# Altium project multimeter.prjpcb
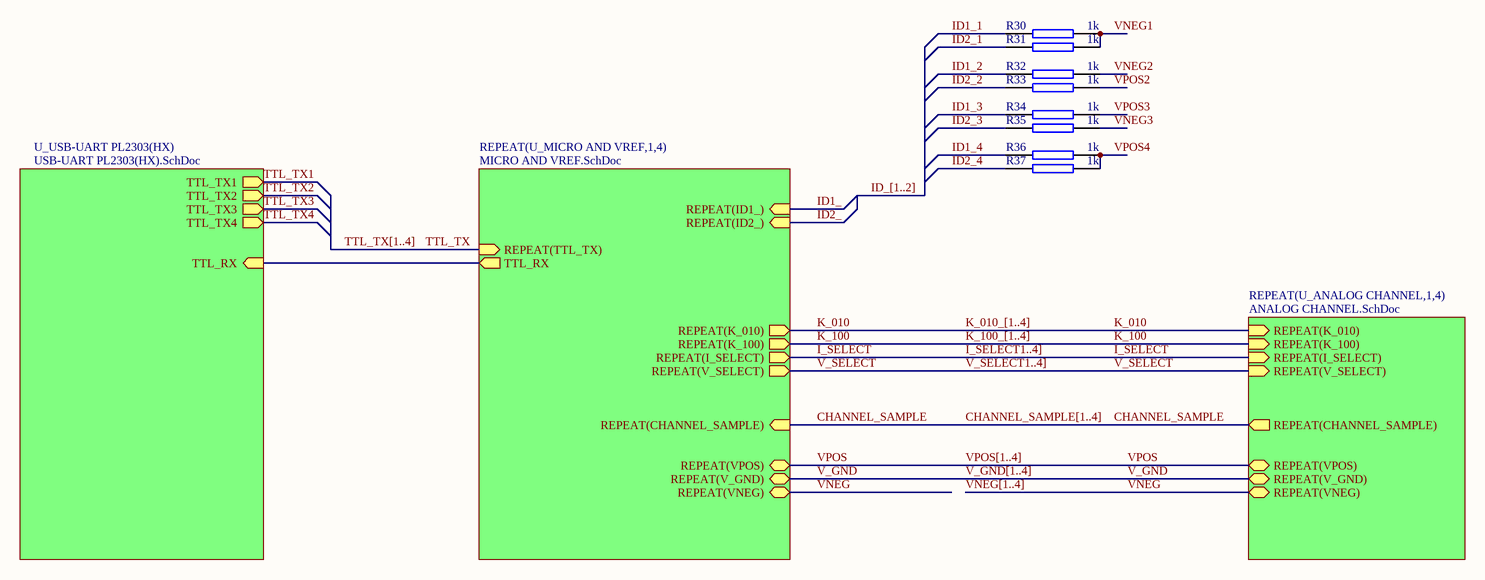
[diagram p0: Multi2Meter.SchDoc]
4 sheets, 194 parts. Net scope: hierarchical (ports join the sheet entries above them; power ports are global).
Board files: m2m V00 End Plate V100.PcbDoc, m2m V00 End Plate 01.PcbDoc, m2m V100.PcbDoc
Sheets:
  Multi2Meter.SchDoc
    U_ANALOG CHANNEL1 = ANALOG CHANNEL.SchDoc
    U_ANALOG CHANNEL2 = ANALOG CHANNEL.SchDoc
    U_ANALOG CHANNEL3 = ANALOG CHANNEL.SchDoc
    U_ANALOG CHANNEL4 = ANALOG CHANNEL.SchDoc
    U_MICRO AND VREF1 = MICRO AND VREF.SchDoc
    U_MICRO AND VREF2 = MICRO AND VREF.SchDoc
    U_MICRO AND VREF3 = MICRO AND VREF.SchDoc
    U_MICRO AND VREF4 = MICRO AND VREF.SchDoc
    U_USB-UART PL2303(HX) = USB-UART PL2303(HX).SchDoc

## Sheet Multi2Meter.SchDoc
size A3

### Parts
R30  1k  [RES (3D) - 0603]
R31  1k  [RES (3D) - 0603]
R32  1k  [RES (3D) - 0603]
R33  1k  [RES (3D) - 0603]
R34  1k  [RES (3D) - 0603]
R35  1k  [RES (3D) - 0603]
R36  1k  [RES (3D) - 0603]
R37  1k  [RES (3D) - 0603]

### Sub-sheets
REPEAT(U_ANALOG CHANNEL,1,4) = ANALOG CHANNEL.SchDoc: REPEAT(K_010) (in), REPEAT(K_100) (in), REPEAT(I_SELECT) (in), REPEAT(V_SELECT) (in), REPEAT(CHANNEL_SAMPLE) (out), REPEAT(V_GND) (bidir), REPEAT(VPOS) (bidir), REPEAT(VNEG) (bidir)
REPEAT(U_MICRO AND VREF,1,4) = MICRO AND VREF.SchDoc: REPEAT(TTL_TX) (in), TTL_RX, REPEAT(K_010) (out), REPEAT(K_100) (out), REPEAT(I_SELECT) (out), REPEAT(V_SELECT) (out), REPEAT(CHANNEL_SAMPLE) (in), REPEAT(V_GND) (bidir), REPEAT(VPOS) (bidir), REPEAT(VNEG) (bidir), REPEAT(ID1_) (in), REPEAT(ID2_) (in)
U_USB-UART PL2303(HX) = USB-UART PL2303(HX).SchDoc: TTL_TX1 (out), TTL_TX2 (out), TTL_TX3 (out), TTL_TX4 (out), TTL_RX (in)

### Nets
CHANNEL_SAMPLE: sheet REPEAT(U_ANALOG CHANNEL,1,4)/REPEAT(CHANNEL_SAMPLE), sheet REPEAT(U_MICRO AND VREF,1,4)/REPEAT(CHANNEL_SAMPLE)
I_SELECT: sheet REPEAT(U_ANALOG CHANNEL,1,4)/REPEAT(I_SELECT), sheet REPEAT(U_MICRO AND VREF,1,4)/REPEAT(I_SELECT)
ID1_: sheet REPEAT(U_MICRO AND VREF,1,4)/REPEAT(ID1_)
ID1_1: R30.1  [project net ID1_]
ID1_2: R32.1  [project net ID1_]
ID1_3: R34.1  [project net ID1_]
ID1_4: R36.1  [project net ID1_]
ID2_: sheet REPEAT(U_MICRO AND VREF,1,4)/REPEAT(ID2_)
ID2_1: R31.1  [project net ID2_]
ID2_2: R33.1  [project net ID2_]
ID2_3: R35.1  [project net ID2_]
ID2_4: R37.1  [project net ID2_]
K_010: sheet REPEAT(U_ANALOG CHANNEL,1,4)/REPEAT(K_010), sheet REPEAT(U_MICRO AND VREF,1,4)/REPEAT(K_010)
K_100: sheet REPEAT(U_ANALOG CHANNEL,1,4)/REPEAT(K_100), sheet REPEAT(U_MICRO AND VREF,1,4)/REPEAT(K_100)
TTL_RX: sheet REPEAT(U_MICRO AND VREF,1,4)/TTL_RX, sheet U_USB-UART PL2303(HX)/TTL_RX
TTL_TX: sheet REPEAT(U_MICRO AND VREF,1,4)/REPEAT(TTL_TX)
V_GND: sheet REPEAT(U_ANALOG CHANNEL,1,4)/REPEAT(V_GND), sheet REPEAT(U_MICRO AND VREF,1,4)/REPEAT(V_GND)
V_SELECT: sheet REPEAT(U_ANALOG CHANNEL,1,4)/REPEAT(V_SELECT), sheet REPEAT(U_MICRO AND VREF,1,4)/REPEAT(V_SELECT)
VNEG: sheet REPEAT(U_ANALOG CHANNEL,1,4)/REPEAT(VNEG), sheet REPEAT(U_MICRO AND VREF,1,4)/REPEAT(VNEG)
VNEG1: R30.2 R31.2  [project net VNEG]
VNEG2: R32.2  [project net VNEG]
VNEG3: R35.2  [project net VNEG]
VPOS: sheet REPEAT(U_ANALOG CHANNEL,1,4)/REPEAT(VPOS), sheet REPEAT(U_MICRO AND VREF,1,4)/REPEAT(VPOS)
VPOS2: R33.2  [project net VPOS]
VPOS3: R34.2  [project net VPOS]
VPOS4: R36.2 R37.2  [project net VPOS]

### Buses and harness runs
bus CHANNEL_SAMPLE[1..4]
bus I_SELECT1..4]
bus ID_[1..2]
bus K_010_[1..4]
bus K_100_[1..4]
bus TTL_TX[1..4]
bus V_GND[1..4]
bus V_SELECT1..4]
bus VNEG[1..4]
bus VPOS[1..4]

### Library data of the parts
R30-R37 = RES SMD 0603: RESISTOR SMD 0603; value: 1k

## Sheet ANALOG CHANNEL.SchDoc
size A4; DrawnBy: SML; Revision: 0; SheetNumber: 2; Title2: Title2
Used 4 times, as channels U_ANALOG CHANNEL1, U_ANALOG CHANNEL2, U_ANALOG CHANNEL3, U_ANALOG CHANNEL4. Parts and nets are listed once, with the designators drawn on the sheet.
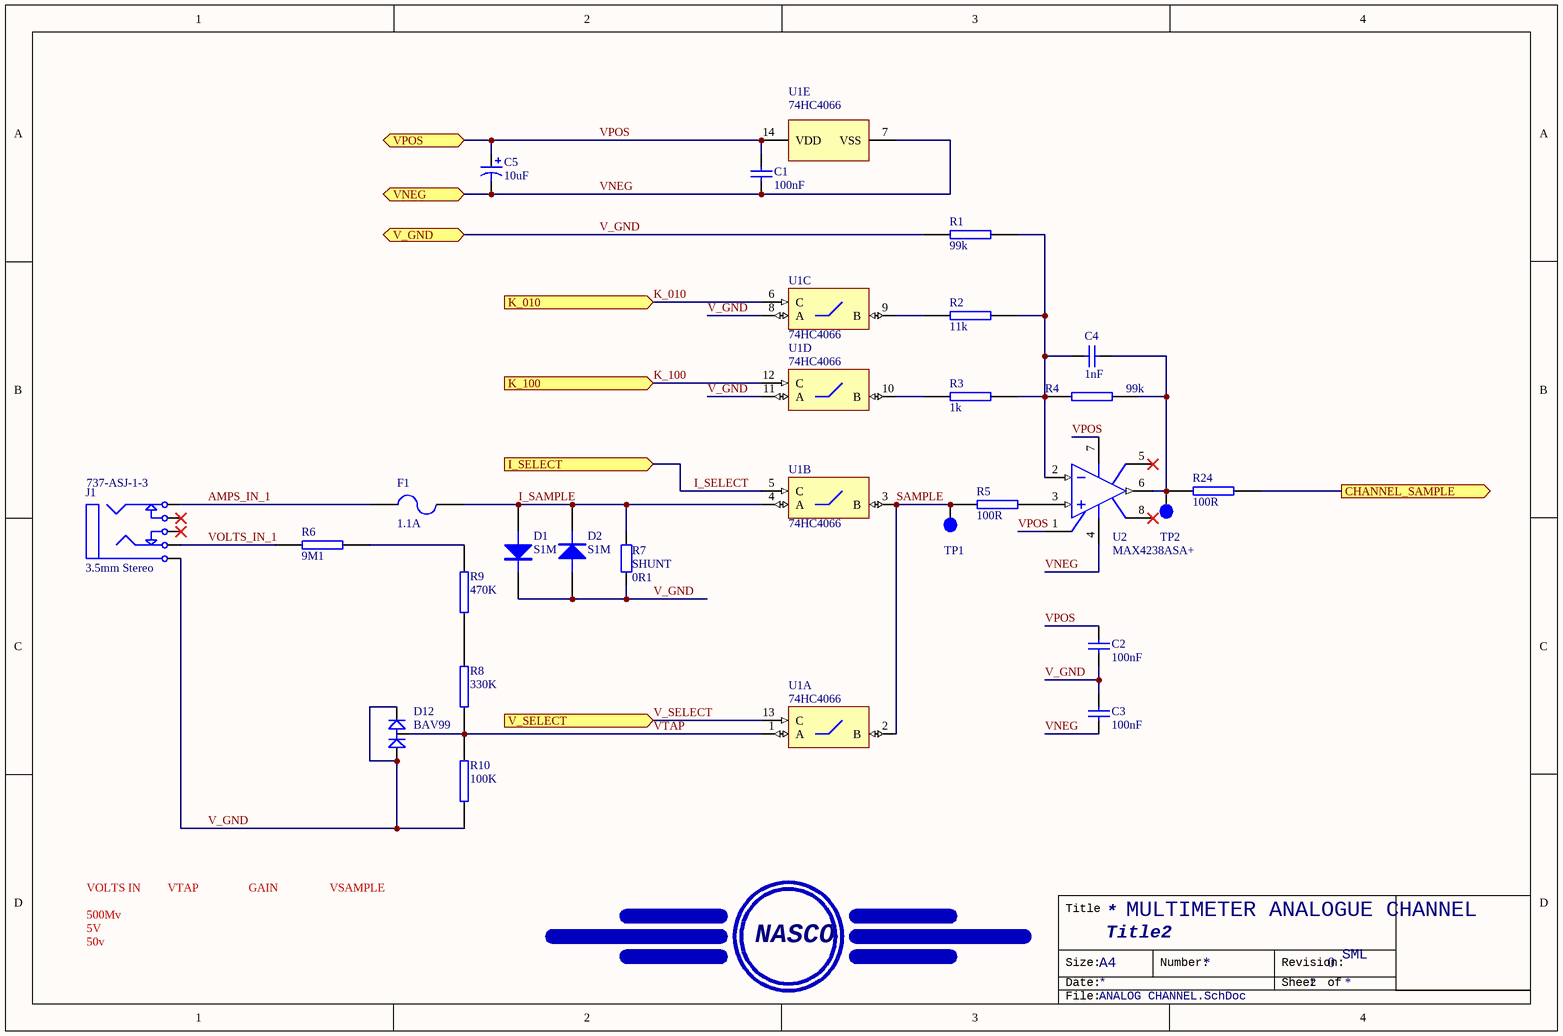
[diagram p1: ANALOG CHANNEL.SchDoc]

### Parts
?  (no value)  (no BOM)
C1  100nF  [CAP (3D) - 0603]
C2  100nF  [CAP (3D) - 0603]
C3  100nF  [CAP (3D) - 0603]
C4  1nF  [CAP (3D) - 0603]
C5  10uF  [CAP ELECTRO SIZE-B]
D1  S1M  [DO-214AC]
D2  S1M  [DO-214AC]
D12  BAV99  [SOT23-3L]
F1  1.1A  [LITTELFUSE 1210]
J1  3.5mm Stereo  Supplier Part Number 1: 737-ASJ-1-3  [3.5MM pcb mouNt]
R1  99k  [RES (3D) - 0603]
R2  11k  [RES (3D) - 0603]
R3  1k  [RES (3D) - 0603]
R4  99k  [RES (3D) - 0603]
R5  100R  [RES (3D) - 0603]
R6  9M1  [RES (3D) - 0603]
R7  SHUNT  value 0R1  [RES (3D) - 1210]
R8  330K  [RES (3D) - 0603]
R9  470K  [RES (3D) - 0603]
R10  100K  [RES (3D) - 0603]
R24  100R  [RES (3D) - 0603]
TP1  TestPoint  [TP]  (value not drawn)
TP2  TestPoint  [TP]  (value not drawn)
U1  74HC4066  [DIP-16]  (parts A,B,C,D,E of 5)
U2  MAX4238ASA+  [SO-8]

### Ports
CHANNEL_SAMPLE (out), I_SELECT (in), K_010 (in), K_100 (in), V_GND (bidir), V_SELECT (in), VNEG (bidir), VPOS (bidir)

### Nets
AMPS_IN_1: F1.1 J1.5
CHANNEL_SAMPLE: R24.2 ; port CHANNEL_SAMPLE
I_SAMPLE: D1.1(A) D2.2(K) F1.2 R7.2 U1.4(A)
I_SELECT: U1.5(C) ; port I_SELECT
K_010: U1.6(C) ; port K_010
K_100: U1.12(C) ; port K_100
SAMPLE: R5.1 TP1.1 U1.2(B) U1.3(B)
V_GND: C2.1 C3.2 D1.2(K) D2.1(A) D12.1(A1) D12.2(C2) J1.1 R1.1 R7.1 R10.2 U1.8(A) U1.11(A) ; port V_GND
V_SELECT: U1.13(C) ; port V_SELECT
VNEG: C1.1 C3.1 C5.2 U1.7(VSS) U2.4(VEE) ; port VNEG
VOLTS_IN_1: J1.2 R6.1
VPOS: C1.2 C2.2 C5.1 U1.14(VDD) U2.1(NULL) U2.7(VCC) ; port VPOS
VTAP: D12.3(C1/A2) R8.2 R10.1 U1.1(A)
NetC4_1: C4.1 R1.2 R2.2 R3.2 R4.1 U2.2(IN-)
NetC4_2: C4.2 R4.2 R24.1 TP2.1 U2.6(OUT)
NetR2_1: R2.1 U1.9(B)
NetR3_1: R3.1 U1.10(B)
NetR5_2: R5.2 U2.3(IN+)
NetR6_2: R6.2 R9.1
NetR8_1: R8.1 R9.2

Not connected (* = marked no-connect by the designer): J1 3* 4*; U2 5(NULL)* 8(NC)*

### Channels
U_ANALOG CHANNEL1: designators end in A; ports CHANNEL_SAMPLE=CHANNEL_SAMPLE I_SELECT=I_SELECT K_010=K_010 K_100=K_100 V_GND=V_GND V_SELECT=V_SELECT VNEG=VNEG VPOS=VPOS
U_ANALOG CHANNEL2: designators end in B; ports CHANNEL_SAMPLE=CHANNEL_SAMPLE I_SELECT=I_SELECT K_010=K_010 K_100=K_100 V_GND=V_GND V_SELECT=V_SELECT VNEG=VNEG VPOS=VPOS
U_ANALOG CHANNEL3: designators end in C; ports CHANNEL_SAMPLE=CHANNEL_SAMPLE I_SELECT=I_SELECT K_010=K_010 K_100=K_100 V_GND=V_GND V_SELECT=V_SELECT VNEG=VNEG VPOS=VPOS
U_ANALOG CHANNEL4: designators end in D; ports CHANNEL_SAMPLE=CHANNEL_SAMPLE I_SELECT=I_SELECT K_010=K_010 K_100=K_100 V_GND=V_GND V_SELECT=V_SELECT VNEG=VNEG VPOS=VPOS

### Notes on the sheet
- VOLTS IN
- 500Mv
- VTAP
- GAIN
- VSAMPLE
- MULTIMETER ANALOGUE CHANNEL
- 5V
- 50v
- Title
- NASCO
- Size:
- Date:
- A4
- Number:
- Revision:
- Sheet
- of
- File:

### Library data of the parts
? = NASCO_LOGO: LOGO
C1-C4 = Cap: Capacitor; Supplier 1: Mouser; Supplier 2: Digi-Key; Supplier Part Number 1: 603-C0603ZRY5V9BB104; Supplier Part Number 2: 311-1343-2-ND
  C1-C3: Value: 100nF
  C4: Value: 1nF
C5 = Cap Pol1: Polarized Capacitor (Radial); Value: 10uF
D1 D2 = DIODE: DIODE, POWER; Manufacturer: TAIWAN SEMI; Mouser Part no.: 821-S1M; Manufacturer Part No.: S1M; value: S1M; Web link: http://au.mouser.com/ProductDetail/Taiwan-Semiconductor/S1M/?qs=sGAEpiMZZMtEwUVCuofpuOlSmRjzJonf%252bmrIm0%252bGbjE%3d
D12 = BAV99: DUAL DIODE, BAV99; Manufacturer: FAIRCHILD SEMICONDUCTOR; Mouser Part no.: 771-BAV99/T3; Manufacturer Part No.: BAV99; value: BAV99; Web link: http://au.mouser.com/ProductDetail/NXP/BAV99-T3/?qs=84A%2fDAdkstK527JD1pwcnQ%3d%3d
F1 = Fuse 2: Fuse; Manufacturer: Littlefuse; Manufacturer Part No.: 1206L110THYR; Revision: July-2002: Re-released for DXP Platform.; Mouser Part No.: 576-1206L110THYR; Value: 1.1A; Web link: http://au.mouser.com/ProductDetail/Littelfuse/1206L110THYR/?qs=sGAEpiMZZMu7EFbsM1w0ne5Dyqsx7igC3NaPmo8Qtk8%3d
J1 = Phonejack Stereo SW: 3-Conductor Jack with 2 break contacts (normals) and 2 auxiliary make contacts; Altronics Part no.: P0073; Manufacturer: Neutrik; Manufacturer Part No.: NMJ6HFD2; Mouser Part no.: 550-20301; Web link: http://au.mouser.com/ProductDetail/Neutrik/NMJ6HFD2/?qs=y5MlCMoPWsng3r9W7xlRqw%3d%3d; Supplier 1: Mouser
R1-R5 R24 = RES SMD 0603: RESISTOR SMD 0603
  R1 R4: value: 99k
  R2: value: 11k
  R3: value: 1k
  R5 R24: value: 100R
R6 = RES SMD 0603 10k: RESISTOR SMD 0603 10k; Manufacturer: Vishay/Dale; Manufacturer Part No.: CRCW06038M06FKEA; Mouser Part no.: 71-CRCW0603-8.06M-E3; Web link: http://au.mouser.com/ProductDetail/Vishay/CRCW06038M06FKEA/?qs=y%252bMD5VLd6nuCUjzPeM%2fNuA%3d%3d; value: 9M1
R7 = Res2: Resistor; Published: 8-Jun-2000; LatestRevisionDate: 17-Jul-2002; LatestRevisionNote: Re-released for DXP Platform.; PackageReference: AXIAL-0.4; Publisher: Altium Limited; PackageDescription: Axial Device, Thru-Hole; 2 Leads; 0.4 in Pin Spacing
R8-R10 = RES SMD 0603 10k: RESISTOR SMD 0603 10k
  R8: value: 330K
  R9: value: 470K
  R10: value: 100K
U1 = 74HC4066: Quadruple Bilateral Analog Switch
U2 = MAX495CSA: Single Voltage-Feedback Operational Amplifier; Published: 23-Sep-2002; LatestRevisionDate: 13-Apr-2006; LatestRevisionNote: IPC-7351 Footprint Added.; DatasheetVersion: Rev 2; 9/96; PackageReference: NSO8; Publisher: Altium Limited; PackageDescription: 8-Pin Small Outline Integrated Circuit 1.27 mm Pitch; Code_JEDEC: MS-012-AA; Code_IPC: SOIC127P600-8; ComponentLink1Description: Manufacturer Link; ComponentLink1URL: http://www.maxim-ic.com/; ComponentLink2Description: Datasheet; ComponentLink2URL: http://pdfserv.maxim-ic.com/en/ds/MAX492-MAX495.pdf

## Sheet MICRO AND VREF.SchDoc
size A4
Used 4 times, as channels U_MICRO AND VREF1, U_MICRO AND VREF2, U_MICRO AND VREF3, U_MICRO AND VREF4. Parts and nets are listed once, with the designators drawn on the sheet.
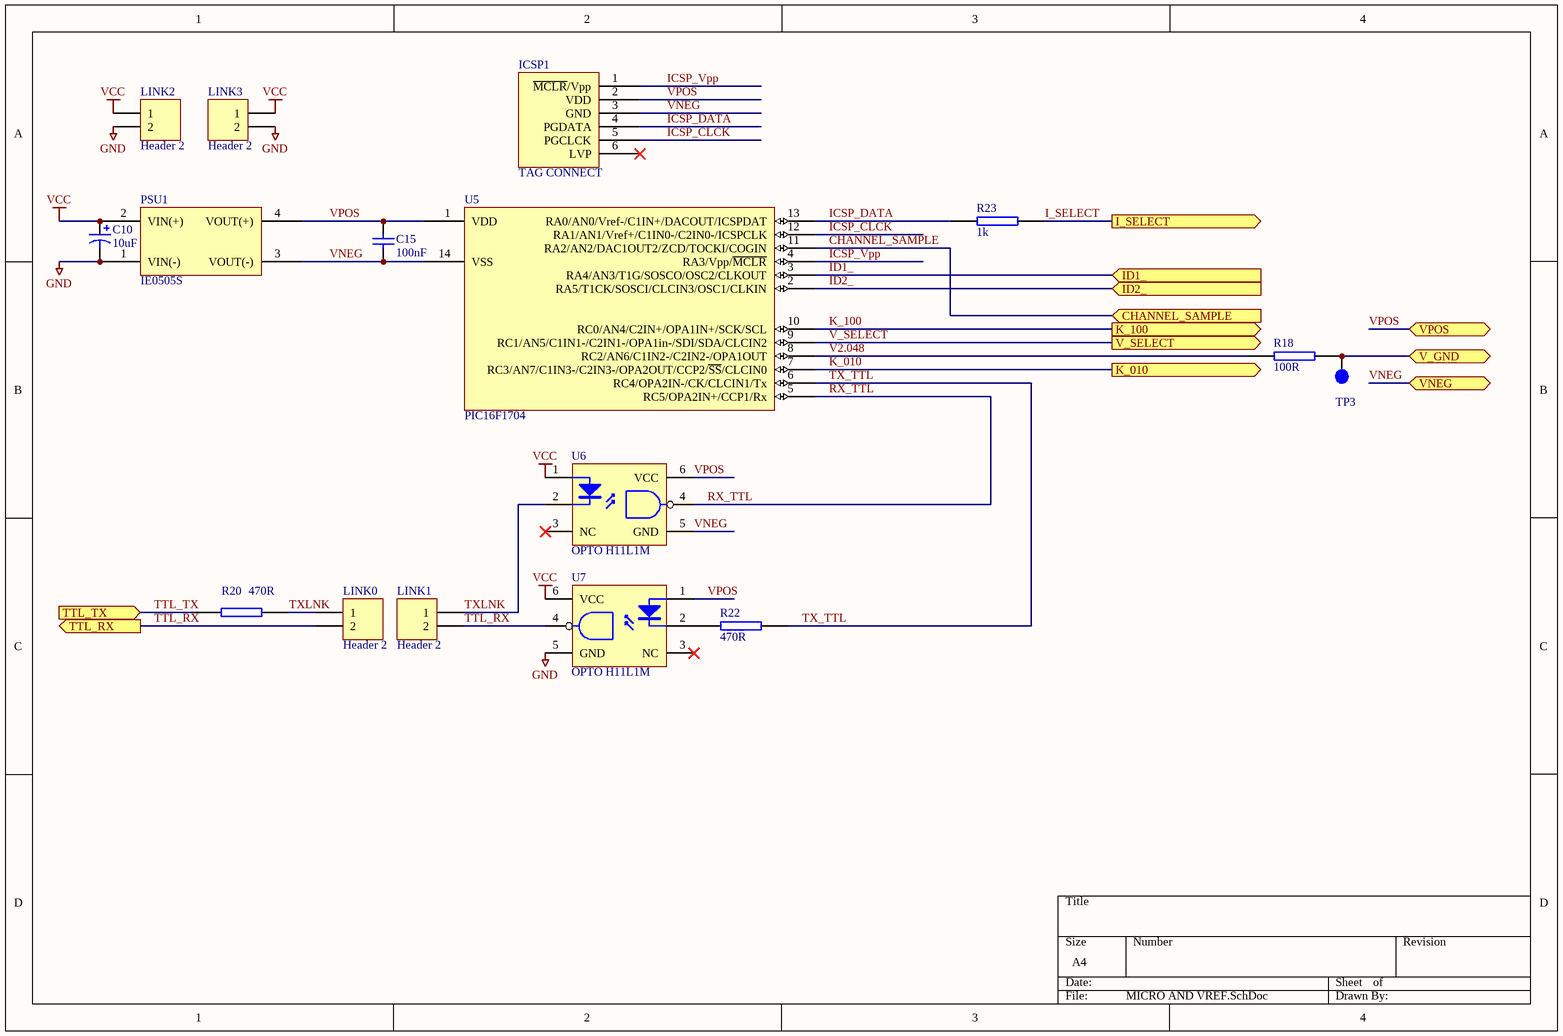
[diagram p2: MICRO AND VREF.SchDoc]

### Parts
C10  10uF  [CAP ELECTRO SIZE-B]
C15  100nF  [CAP (3D) - 0603]
ICSP1  TAG CONNECT  [ICSP - TAG CONNECT TYPE2]
LINK0  Header 2  [HDR1X2]
LINK1  Header 2  [HDR1X2]
LINK2  Header 2  [HDR1X2]
LINK3  Header 2  [HDR1X2]
PSU1  IE0505S  [IE0505S]
R18  100R  [RES (3D) - 0603]
R20  470R  [RES (3D) - 0603]
R22  470R  [RES (3D) - 0603]
R23  1k  [RES (3D) - 0603]
TP3  TestPoint  [TP]  (value not drawn)
U5  PIC16F1704  [SOIC-14]
U6  OPTO H11L1M  [DIP_6]
U7  OPTO H11L1M  [DIP_6]

### Ports
CHANNEL_SAMPLE (in), I_SELECT (out), ID1_ (in), ID2_ (in), K_010 (out), K_100 (out), TTL_RX, TTL_TX (in), V_GND (bidir), V_SELECT (out), VNEG, VPOS

### Nets
GND: C10.2 LINK2.2 LINK3.2 PSU1.1(VIN(-)) U7.5(GND)
VCC: C10.1 LINK2.1 LINK3.1 PSU1.2(VIN(+)) U6.1(A) U7.6(VCC)
CHANNEL_SAMPLE: U5.11(RA2/AN2/DAC1OUT2/ZCD/TOCKI/COGIN) ; port CHANNEL_SAMPLE
I_SELECT: R23.2 ; port I_SELECT
ICSP_CLCK: ICSP1.5(PGCLCK) U5.12(RA1/AN1/Vref+/C1IN0-/C2IN0-/ICSPCLK)
ICSP_DATA: ICSP1.4(PGDATA) R23.1 U5.13(RA0/AN0/Vref-/C1IN+/DACOUT/ICSPDAT)
ICSP_Vpp: ICSP1.1(~{MCLR}/Vpp) U5.4(RA3/Vpp/~{MCLR})
ID1_: U5.3(RA4/AN3/T1G/SOSCO/OSC2/CLKOUT) ; port ID1_
ID2_: U5.2(RA5/T1CK/SOSCI/CLCIN3/OSC1/CLKIN) ; port ID2_
K_010: U5.7(RC3/AN7/C1IN3-/C2IN3-/OPA2OUT/CCP2/~{SS}/CLCIN0) ; port K_010
K_100: U5.10(RC0/AN4/C2IN+/OPA1IN+/SCK/SCL) ; port K_100
RX_TTL: U5.5(RC5/OPA2IN+/CCP1/Rx) U6.4(Q)
TTL_RX: LINK0.2 LINK1.2 U7.4(Q) ; port TTL_RX
TTL_TX: R20.1 ; port TTL_TX
TX_TTL: R22.2 U5.6(RC4/OPA2IN-/CK/CLCIN1/Tx)
TXLNK: LINK0.1 LINK1.1 R20.2 U6.2(K)
V2.048: R18.1 U5.8(RC2/AN6/C1IN2-/C2IN2-/OPA1OUT)
V_GND: R18.2 TP3.1 ; port V_GND
V_SELECT: U5.9(RC1/AN5/C1IN1-/C2IN1-/OPA1in-/SDI/SDA/CLCIN2) ; port V_SELECT
VNEG: C15.1 ICSP1.3(GND) PSU1.3(VOUT(-)) U5.14(VSS) U6.5(GND) ; port VNEG
VPOS: C15.2 ICSP1.2(VDD) PSU1.4(VOUT(+)) U5.1(VDD) U6.6(VCC) U7.1(A) ; port VPOS
NetR22_1: R22.1 U7.2(K)

Not connected (* = marked no-connect by the designer): ICSP1 6(LVP)*; U6 3(NC)*; U7 3(NC)*

### Channels
U_MICRO AND VREF1: designators end in A; ports CHANNEL_SAMPLE=CHANNEL_SAMPLE I_SELECT=I_SELECT ID1_=ID1_ ID2_=ID2_ K_010=K_010 K_100=K_100 TTL_RX=TTL_RX TTL_TX=TTL_TX V_GND=V_GND V_SELECT=V_SELECT VNEG=VNEG VPOS=VPOS
U_MICRO AND VREF2: designators end in B; ports CHANNEL_SAMPLE=CHANNEL_SAMPLE I_SELECT=I_SELECT ID1_=ID1_ ID2_=ID2_ K_010=K_010 K_100=K_100 TTL_RX=TTL_RX TTL_TX=TTL_TX V_GND=V_GND V_SELECT=V_SELECT VNEG=VNEG VPOS=VPOS
U_MICRO AND VREF3: designators end in C; ports CHANNEL_SAMPLE=CHANNEL_SAMPLE I_SELECT=I_SELECT ID1_=ID1_ ID2_=ID2_ K_010=K_010 K_100=K_100 TTL_RX=TTL_RX TTL_TX=TTL_TX V_GND=V_GND V_SELECT=V_SELECT VNEG=VNEG VPOS=VPOS
U_MICRO AND VREF4: designators end in D; ports CHANNEL_SAMPLE=CHANNEL_SAMPLE I_SELECT=I_SELECT ID1_=ID1_ ID2_=ID2_ K_010=K_010 K_100=K_100 TTL_RX=TTL_RX TTL_TX=TTL_TX V_GND=V_GND V_SELECT=V_SELECT VNEG=VNEG VPOS=VPOS

### Library data of the parts
C10 = Cap Pol1: Polarized Capacitor (Radial); Value: 10uF
C15 = Cap: Capacitor; Value: 100nF; Supplier 1: Mouser; Supplier 2: Digi-Key; Supplier Part Number 1: 603-C0603ZRY5V9BB104; Supplier Part Number 2: 311-1343-2-ND
ICSP1 = ICSP - TAG CONNECT: Manufacturer: N/A - PCB ARTWORK; Manufacturer Part No.: N/A; Mouser Part no.: N/A; Web link: N/A - PCB ARTWORK
LINK0-LINK3 = Header 2: Header, 2-Pin; LatestRevisionDate: 17-Jul-2002; LatestRevisionNote: Re-released for DXP Platform.; Publisher: Altium Limited
PSU1 = 5V ISOLATED: XP POWER IE0505S; Farnell Part no.: 8727694; Manufacturer: XP POWER; value: IE0505S; Web link: http://au.element14.com/jsp/displayProduct.jsp?sku=8727694&CMP=KNC-GOO-SKU-OTH&mckv=sbz05Gxuo|pcrid|11128913208|pkw|ie0505s|pmt|p&s_kwcid=TC|15109|ie0505s|S|p|11128913208
R18 R23 = RES SMD 0603: RESISTOR SMD 0603
  R18: value: 100R
  R23: value: 1k
R20 R22 = RES SMD 0603 1k: RESISTOR SMD 0603 1k; value: 470R
U6 U7 = H11L1M: 6-Pin Logic Output Optocoupler
U5 = PIC16F1704: Web Link: http://au.mouser.com/ProductDetail/Microchip-Technology/PIC16F1823-I-SL/?qs=sGAEpiMZZMvqv2n3s2xjsW2MXUmlRZqtARQgJEn43Ss%3d

## Sheet USB-UART PL2303(HX).SchDoc
size A4
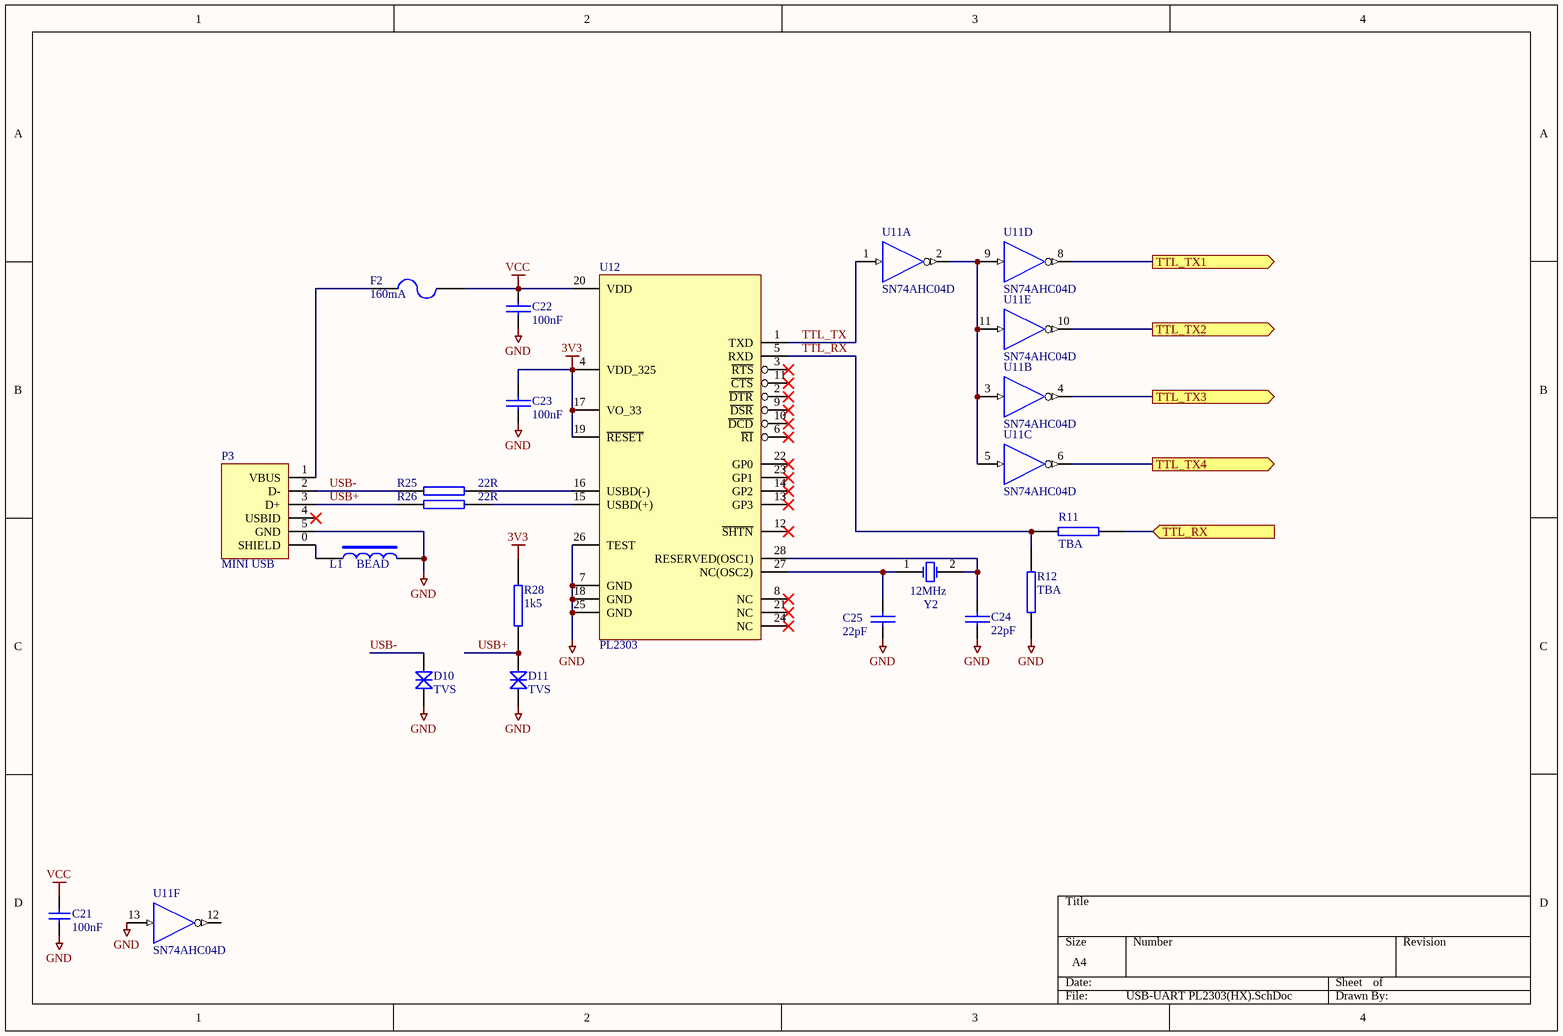
[diagram p3: USB-UART PL2303(HX).SchDoc]

### Parts
C21  100nF  [CAP (3D) - 0603]
C22  100nF  [CAP (3D) - 0603]
C23  100nF  [CAP (3D) - 0603]
C24  22pF  [CAP (3D) - 0603]
C25  22pF  [CAP (3D) - 0603]
D10  TVS  [TVS (3D) - 0603]
D11  TVS  [TVS (3D) - 0603]
F2  160mA  [1206]
L1  BEAD  [RES (3D) - 1210]
P3  MINI USB  [MINI USB]
R11  TBA  [RES (3D) - 0603]
R12  TBA  [RES (3D) - 0603]
R25  22R  [RES (3D) - 0603]
R26  22R  [RES (3D) - 0603]
R28  1k5  [RES (3D) - 0603]
U11  SN74AHC04D  [SOIC-14]  (parts A,B,C,D,E,F of 6)
U12  PL2303  [SSOP28]
Y2  value 12MHz  [HC49/4H_SMX]  (hidden comment: XTAL)

### Ports
TTL_RX, TTL_TX1 (out), TTL_TX2 (out), TTL_TX3 (out), TTL_TX4 (out)

### Nets
3V3: C23.1 R28.1 U12.4(VDD_325) U12.17(VO_33) U12.19(~{RESET})
GND: C21.1 C22.2 C23.2 C24.2 C25.2 D10.1(A) D11.1(A) L1.2 P3.5(GND) R12.1 U11.7(GND) U11.13(A) U12.7(GND) U12.18(GND) U12.25(GND) U12.26(TEST)
VCC: C21.2 C22.1 F2.2 U11.14(VCC) U12.20(VDD)
TTL_RX: R11.2 ; port TTL_RX
TTL_RX: R11.1 R12.2 U12.5(RXD)  [a separate net that carries the same name]
TTL_TX: U11.8(Y) ; port TTL_TX1
TTL_TX: U11.10(Y) ; port TTL_TX2  [a separate net that carries the same name]
TTL_TX: U11.4(Y) ; port TTL_TX3  [a separate net that carries the same name]
TTL_TX: U11.6(Y) ; port TTL_TX4  [a separate net that carries the same name]
TTL_TX: U11.1(A) U12.1(TXD)  [a separate net that carries the same name]
USB+: D11.2(K) P3.3(D+) R26.1 R28.2
USB-: D10.2(K) P3.2(D-) R25.1
NetC24_1: C24.1 U12.28(RESERVED(OSC1)) Y2.2(OSC2)
NetC25_1: C25.1 U12.27(NC(OSC2)) Y2.1(OSC1)
NetF2_1: F2.1 P3.1(VBUS)
NetL1_1: L1.1 P3.0(SHIELD)
NetR25_2: R25.2 U12.16(USBD(-))
NetR26_2: R26.2 U12.15(USBD(+))
NetU11_2: U11.2(Y) U11.3(A) U11.5(A) U11.9(A) U11.11(A)

Not connected (* = marked no-connect by the designer): P3 4(USBID)*; U11 12(Y); U12 2(~{DTR})* 3(~{RTS})* 6(~{RI})* 8(NC)* 9(~{DSR})* 10(~{DCD})* 11(~{CTS})* 12(~{SHTN})* 13(GP3)* 14(GP2)* 21(NC)* 22(GP0)* 23(GP1)* 24(NC)*

### Library data of the parts
C21 = Cap: Capacitor; Value: 100nF; Supplier 1: Mouser; Supplier 2: Digi-Key; Supplier Part Number 1: 603-C0603ZRY5V9BB104; Supplier Part Number 2: 311-1343-2-ND
C22 C23 = CAP SMD 0603 100nF: CAPACITOR SMD 0603; Manufacturer: Murata; Manufacturer Part No.: GCM188R71C104KA37D; Mouser Part no.: 81-GCM188R71C104KA7D; Web link: http://au.mouser.com/ProductDetail/Murata/GCM188R71C104KA37D/?qs=aEuGZpxfbxWKAxwYn%252beTMg%3d%3d; value: 100nF
C24 C25 = CAP SMD 0603 1nF: CAPACITOR SMD 0603; Manufacturer: Vishay; Manufacturer Part No.: VJ0603A220JXACW1BC; value: 22pF; Mouser Part no.: 77-VJ0603A220JXACBC; Web link: http://au.mouser.com/ProductDetail/Vishay-Vitramon/VJ0603A220JXACW1BC/?qs=sGAEpiMZZMv9Q1JI0Mo%2ftTD%2f4380kv7n
D10 D11 = TVS DIODE: Transient Voltage Suppression (TVS) Diode; Manufacturer Part No.: CG0603MLC-05E; Manufacturer: Bourns; Value: TVS; Mouser Part no.: 652-CG0603MLC-05E; Web link: http://au.mouser.com/ProductDetail/Bourns/CG0603MLC-05E/?qs=%2fha2pyFaduj8GWc5RpRwWsoz%252bsBNDfM0b%2fMwO0m8cAS%252b28tb9AwLWQ%3d%3d
F2 = Fuse 2: Fuse; Manufacturer: Littlefuse; Manufacturer Part No.: 1206L016WR; Revision: July-2002: Re-released for DXP Platform.; Mouser Part No.: 576-1206L016WR; Value: 160mA; Web link: http://au.mouser.com/ProductDetail/Littelfuse/1206L016WR/?qs=PWhpLWeW8weybSDHdny44Q%3d%3d
L1 = INDUCTOR SMD 1210 100uH: INDUCTOR SMD 1210; Manufacturer: Fair-Rite; Manufacturer Part No.: 2512063007Y3; Mouser Part no.: 636-2512063007Y3; Web link: http://au.mouser.com/ProductDetail/Fair-Rite/2512063007Y3/?qs=%2fha2pyFadugMqBZ0p6tBCteJ%252bl1Ngi4ZSrBdKx9yVdYrQlmO7YKqKA%3d%3d; Value: BEAD
P3 = MICRO USB: Manufacturer: Keystone Electronics; Manufacturer Part No.: 534-934; value: USB-MICRO; Mouser Part no.: 934; Web link: http://au.mouser.com/ProductDetail/Keystone-Electronics/934/?qs=sGAEpiMZZMulM8LPOQ%252byk%2fSsgKophuqxMvSf7TGGJTc%3d
R11 R12 R25 R26 = RES SMD 0603 0R: RESISTOR SMD 0603 0R; Manufacturer: Xicon; Manufacturer Part No.: 301-22-RC; Mouser Part no.: 301-22-RC; Web link: http://au.mouser.com/ProductDetail/Xicon/301-22-RC/?qs=sGAEpiMZZMu61qfTUdNhG77xSY1jRpIyXwGVN4E99m8%3d
  R11 R12: value: TBA
  R25 R26: value: 22R
R28 = RES SMD 0603 0R: RESISTOR SMD 0603 0R; value: 1k5
U11 = SN74AHC04D: Hex Inverter; Published: 8-Jun-2000; LatestRevisionDate: 13-Apr-2006; LatestRevisionNote: IPC-7351 Footprint Added.; DatasheetVersion: Jun-1998; PackageVersion: Jan-1998; PackageReference: D014; Publisher: Altium Limited; PackageDescription: 14-Pin Small Outline Integrated Circuit 1.27 mm Pitch; Code_IPC: SOIC127P600-14; ComponentLink1Description: Manufacturer Link; ComponentLink1URL: http://www.ti.com/; ComponentLink2Description: Datasheet; ComponentLink2URL: http://www-s.ti.com/sc/ds/sn74ahc04.pdf; ComponentLink3Description: Packaging Specification; ComponentLink3URL: http://focus.ti.com/lit/ml/mpds177/mpds177.pdf
U12 = PL2303: PL2303 USB to 232 Converter (FT232 Compatible)
Y2 = XTAL: Crystal Oscillator; Web link: http://au.mouser.com/ProductDetail/ECS/ECS-160-20-5PX-TR/?qs=CkbNAJEAr%2fRSmE52Hssuc4XnCMYWVt7B

## Nets that join several sheets
GND: U_MICRO AND VREF1 (5 pins), U_MICRO AND VREF2 (5 pins), U_MICRO AND VREF3 (5 pins), U_MICRO AND VREF4 (5 pins), USB-UART PL2303(HX) (16 pins)
VCC: U_MICRO AND VREF1 (6 pins), U_MICRO AND VREF2 (6 pins), U_MICRO AND VREF3 (6 pins), U_MICRO AND VREF4 (6 pins), USB-UART PL2303(HX) (5 pins)
CHANNEL_SAMPLE: U_ANALOG CHANNEL1 (R24A.2), U_MICRO AND VREF1 (U5A.11)
CHANNEL_SAMPLE: U_ANALOG CHANNEL2 (R24B.2), U_MICRO AND VREF2 (U5B.11)
CHANNEL_SAMPLE: U_ANALOG CHANNEL3 (R24C.2), U_MICRO AND VREF3 (U5C.11)
CHANNEL_SAMPLE: U_ANALOG CHANNEL4 (R24D.2), U_MICRO AND VREF4 (U5D.11)
I_SELECT: U_ANALOG CHANNEL1 (U1A.5), U_MICRO AND VREF1 (R23A.2)
I_SELECT: U_ANALOG CHANNEL2 (U1B.5), U_MICRO AND VREF2 (R23B.2)
I_SELECT: U_ANALOG CHANNEL3 (U1C.5), U_MICRO AND VREF3 (R23C.2)
I_SELECT: U_ANALOG CHANNEL4 (U1D.5), U_MICRO AND VREF4 (R23D.2)
ID1_: Multi2Meter (R30.1), U_MICRO AND VREF1 (U5A.3)
ID1_: Multi2Meter (R32.1), U_MICRO AND VREF2 (U5B.3)
ID1_: Multi2Meter (R34.1), U_MICRO AND VREF3 (U5C.3)
ID1_: Multi2Meter (R36.1), U_MICRO AND VREF4 (U5D.3)
ID2_: Multi2Meter (R31.1), U_MICRO AND VREF1 (U5A.2)
ID2_: Multi2Meter (R33.1), U_MICRO AND VREF2 (U5B.2)
ID2_: Multi2Meter (R35.1), U_MICRO AND VREF3 (U5C.2)
ID2_: Multi2Meter (R37.1), U_MICRO AND VREF4 (U5D.2)
K_010: U_ANALOG CHANNEL1 (U1A.6), U_MICRO AND VREF1 (U5A.7)
K_010: U_ANALOG CHANNEL2 (U1B.6), U_MICRO AND VREF2 (U5B.7)
K_010: U_ANALOG CHANNEL3 (U1C.6), U_MICRO AND VREF3 (U5C.7)
K_010: U_ANALOG CHANNEL4 (U1D.6), U_MICRO AND VREF4 (U5D.7)
K_100: U_ANALOG CHANNEL1 (U1A.12), U_MICRO AND VREF1 (U5A.10)
K_100: U_ANALOG CHANNEL2 (U1B.12), U_MICRO AND VREF2 (U5B.10)
K_100: U_ANALOG CHANNEL3 (U1C.12), U_MICRO AND VREF3 (U5C.10)
K_100: U_ANALOG CHANNEL4 (U1D.12), U_MICRO AND VREF4 (U5D.10)
TTL_RX: U_MICRO AND VREF1 (LINK0A.2 LINK1A.2 U7A.4), U_MICRO AND VREF2 (LINK0B.2 LINK1B.2 U7B.4), U_MICRO AND VREF3 (LINK0C.2 LINK1C.2 U7C.4), U_MICRO AND VREF4 (LINK0D.2 LINK1D.2 U7D.4), USB-UART PL2303(HX) (R11.2)
TTL_TX: U_MICRO AND VREF1 (R20A.1), USB-UART PL2303(HX) (U11.8)
TTL_TX: U_MICRO AND VREF2 (R20B.1), USB-UART PL2303(HX) (U11.10)
TTL_TX: U_MICRO AND VREF3 (R20C.1), USB-UART PL2303(HX) (U11.4)
TTL_TX: U_MICRO AND VREF4 (R20D.1), USB-UART PL2303(HX) (U11.6)
V_GND: U_ANALOG CHANNEL1 (12 pins), U_MICRO AND VREF1 (R18A.2 TP3A.1)
V_GND: U_ANALOG CHANNEL2 (12 pins), U_MICRO AND VREF2 (R18B.2 TP3B.1)
V_GND: U_ANALOG CHANNEL3 (12 pins), U_MICRO AND VREF3 (R18C.2 TP3C.1)
V_GND: U_ANALOG CHANNEL4 (12 pins), U_MICRO AND VREF4 (R18D.2 TP3D.1)
V_SELECT: U_ANALOG CHANNEL1 (U1A.13), U_MICRO AND VREF1 (U5A.9)
V_SELECT: U_ANALOG CHANNEL2 (U1B.13), U_MICRO AND VREF2 (U5B.9)
V_SELECT: U_ANALOG CHANNEL3 (U1C.13), U_MICRO AND VREF3 (U5C.9)
V_SELECT: U_ANALOG CHANNEL4 (U1D.13), U_MICRO AND VREF4 (U5D.9)
VNEG: Multi2Meter (R30.2 R31.2), U_ANALOG CHANNEL1 (5 pins), U_MICRO AND VREF1 (5 pins)
VNEG: Multi2Meter (R32.2), U_ANALOG CHANNEL2 (5 pins), U_MICRO AND VREF2 (5 pins)
VNEG: Multi2Meter (R35.2), U_ANALOG CHANNEL3 (5 pins), U_MICRO AND VREF3 (5 pins)
VNEG: U_ANALOG CHANNEL4 (5 pins), U_MICRO AND VREF4 (5 pins)
VPOS: Multi2Meter (R33.2), U_ANALOG CHANNEL2 (6 pins), U_MICRO AND VREF2 (6 pins)
VPOS: Multi2Meter (R34.2), U_ANALOG CHANNEL3 (6 pins), U_MICRO AND VREF3 (6 pins)
VPOS: Multi2Meter (R36.2 R37.2), U_ANALOG CHANNEL4 (6 pins), U_MICRO AND VREF4 (6 pins)
VPOS: U_ANALOG CHANNEL1 (6 pins), U_MICRO AND VREF1 (6 pins)